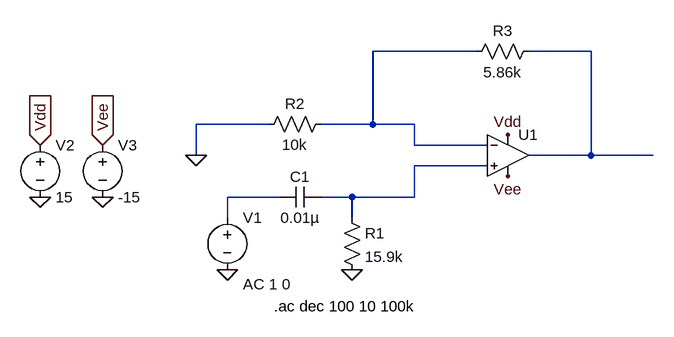
[diagram p0: schematic Draft1.asc]
Draft1.asc, the LTspice schematic file:
Version 4
SHEET 1 884 680
WIRE 608 80 448 80
WIRE 784 80 688 80
WIRE 288 192 176 192
WIRE 448 192 448 80
WIRE 448 192 368 192
WIRE 512 192 448 192
WIRE 512 224 512 192
WIRE 624 224 512 224
WIRE 176 240 176 192
WIRE 784 240 784 80
WIRE 784 240 688 240
WIRE 880 240 784 240
WIRE 624 256 512 256
WIRE 304 304 224 304
WIRE 416 304 368 304
WIRE 512 304 512 256
WIRE 512 304 416 304
WIRE 224 336 224 304
WIRE 416 336 416 304
FLAG 224 416 0
FLAG 416 416 0
FLAG 176 240 0
FLAG -64 224 Vdd
IOPIN -64 224 In
FLAG 32 224 Vee
IOPIN 32 224 In
FLAG -64 304 0
FLAG 32 304 0
FLAG 656 208 Vdd
FLAG 656 272 Vee
SYMBOL Voltage 224 320 R0
WINDOW 123 24 118 Left 2
SYMATTR InstName V1
SYMATTR Value ""
SYMATTR Value2 AC 1 0
SYMBOL Voltage -64 208 R0
SYMATTR InstName V2
SYMATTR Value 15
SYMBOL Voltage 32 208 R0
SYMATTR InstName V3
SYMATTR Value -15
SYMBOL Res 400 320 R0
SYMATTR InstName R1
SYMATTR Value 15.9k
SYMBOL Cap 368 288 R90
WINDOW 0 0 32 VBottom 2
WINDOW 3 32 32 VTop 2
SYMATTR InstName C1
SYMATTR Value 0.01µ
SYMBOL Res 384 176 R90
WINDOW 0 0 56 VBottom 2
WINDOW 3 32 56 VTop 2
SYMATTR InstName R2
SYMATTR Value 10k
SYMBOL OpAmps/UniversalOpAmp 656 240 R0
SYMATTR InstName U1
SYMBOL Res 704 64 R90
WINDOW 0 0 56 VBottom 2
WINDOW 3 32 56 VTop 2
SYMATTR InstName R3
SYMATTR Value 5.86k
TEXT 296 472 Left 2 !.ac dec 100 10 100k

The netlist it stands for:
* Draft1.asc
V1 N004 0 AC 1 0
V2 Vdd 0 15
V3 Vee 0 -15
R1 N003 0 15.9k
C1 N003 N004 0.01µ
R2 N001 0 10k
XU1 N003 N001 Vdd Vee N002 level1 Avol=1Meg GBW=10Meg Vos=0 En=0 Enk=0 In=0 Ink=0 Rin=500Meg  ; pins In+ In- V+ V- OUT
R3 N002 N001 5.86k
.ac dec 100 10 100k
.lib UniversalOpAmp1.lib
.backanno
.end